# EAGLE schematic BeagleBoard-Fluxos (EAGLE 7.2.0)
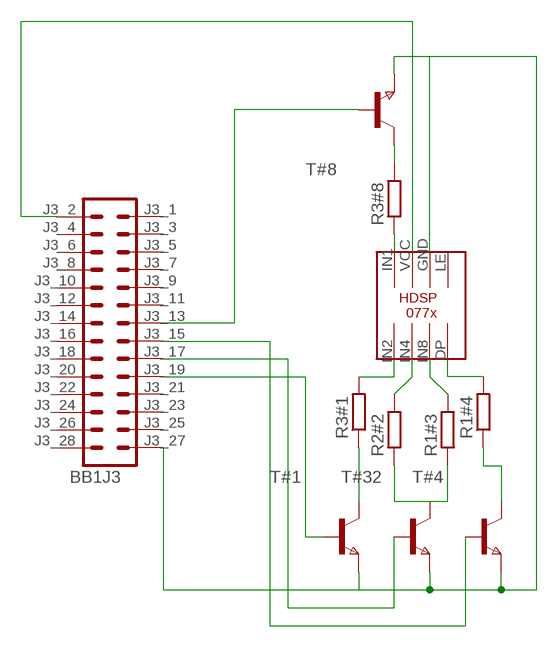
[diagram p0: schematic, sheet 1]

## Parts
BB1  BEAGLE_EXPANSION  [BEAGLE_EXPANSION]
R1#3  R-EU_0309/12  [0309/12]
R1#4  R-EU_0309/12  [0309/12]
R2#2  R-EU_0309/12  [0309/12]
R3#1  R-EU_0309/12  [0309/12]
R3#8  R-EU_0309/12  [0309/12]
T#1  NPNSOT323  [SOT323]
T#4  NPNSOT323  [SOT323]
T#8  NPNSOT323  [SOT323]
T#32  NPNSOT323  [SOT323]
U$1  HDSP-077X  [HDSP-077X]

## Nets
N$1: BB1.J3_2 U$1.VCC
N$2: BB1.J3_27 T#1.3(E) T#4.3(E) T#8.3(E) T#32.3(E) U$1.GND
N$3: R1#3.2 U$1.IN8
N$4: R2#2.2 U$1.IN4
N$5: R1#4.2 U$1.DP
N$6: R3#8.1 U$1.IN1
N$7: R3#1.2 U$1.IN2
N$8: R3#1.1 T#1.1(C)
N$9: R1#3.1 R2#2.1 T#32.1(C)
N$10: R1#4.1 T#4.1(C)
N$12: R3#8.2 T#8.1(C)
N$13: BB1.J3_19 T#1.2(B)
N$14: BB1.J3_17 T#32.2(B)
N$15: BB1.J3_15 T#4.2(B)
N$16: BB1.J3_13 T#8.2(B)
Unconnected: BB1.J3_1 BB1.J3_3 BB1.J3_4 BB1.J3_5 BB1.J3_6 BB1.J3_7 BB1.J3_8 BB1.J3_9 BB1.J3_10 BB1.J3_11 BB1.J3_12 BB1.J3_14 BB1.J3_16 BB1.J3_18 BB1.J3_20 BB1.J3_21 BB1.J3_22 BB1.J3_23 BB1.J3_24 BB1.J3_25 BB1.J3_26 BB1.J3_28 BB1.J4_1 BB1.J4_2 BB1.J4_3 BB1.J4_4 BB1.J4_5 BB1.J4_6 BB1.J4_7 BB1.J4_8 BB1.J4_9 BB1.J4_10 BB1.J4_11 BB1.J4_12 BB1.J4_13 BB1.J4_14 BB1.J4_15 BB1.J4_16 BB1.J4_17 BB1.J4_18 BB1.J4_19 BB1.J4_20 BB1.J5_1 BB1.J5_2 BB1.J5_3 BB1.J5_4 BB1.J5_5 BB1.J5_6 BB1.J5_7 BB1.J5_8 BB1.J5_9 BB1.J5_10 BB1.J5_11 BB1.J5_12 BB1.J5_13 BB1.J5_14 BB1.J5_15 BB1.J5_16 BB1.J5_17 BB1.J5_18 BB1.J5_19 BB1.J5_20 U$1.LE

## Library data of the parts
BB1 = dab5267:BEAGLE_EXPANSION: BeagleBoard C4 Expansion Provides pinouts for J3, J4, and J5. J3 is the main expansion header. J4 is the first LCD connector. J5 is the second LCD connector.
R1#3 R1#4 R2#2 R3#1 R3#8 = resistor:R-EU_: RESISTOR, European symbol
T#1 T#4 T#8 T#32 = zetex:NPNSOT323: NPN TRANSISTOR; MPN: DSS4160U-7; OC_FARNELL: 1710696; OC_NEWARK: 25R4558
U$1 = 7Segments:HDSP-077X